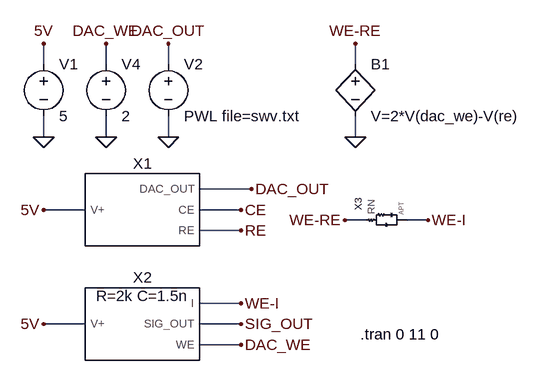
[diagram p0: schematic Mixed System.asc]
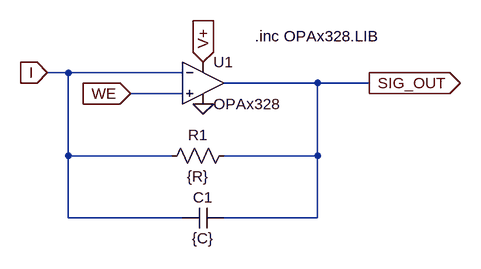
[diagram p1: sub-circuit opa2328_trans_amp.asc]
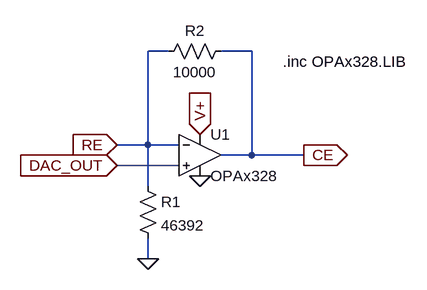
[diagram p2: sub-circuit opa2328_control_amp.asc]
Mixed System.asc, the LTspice schematic file:
Version 4
SHEET 1 880 680
WIRE -192 -128 -192 -160
WIRE -96 -128 -96 -160
WIRE 0 -128 0 -160
WIRE 288 -128 288 -160
WIRE -192 -16 -192 -48
WIRE -96 -16 -96 -48
WIRE 0 -16 0 -48
WIRE 288 -16 288 -48
WIRE 128 64 48 64
WIRE -128 96 -192 96
WIRE 112 96 48 96
WIRE 304 112 272 112
WIRE 400 112 368 112
WIRE 112 128 48 128
WIRE 112 240 48 240
WIRE -128 272 -192 272
WIRE 112 272 48 272
WIRE 112 304 48 304
FLAG -192 -16 0
FLAG -192 -160 5V
FLAG -192 96 5V
FLAG -192 272 5V
FLAG 0 -16 0
FLAG 0 -160 DAC_OUT
FLAG 128 64 DAC_OUT
FLAG 112 96 CE
FLAG 112 128 RE
FLAG 288 -160 WE-RE
FLAG 400 112 WE-I
FLAG 112 240 WE-I
FLAG 272 112 WE-RE
FLAG 112 272 SIG_OUT
FLAG -96 -16 0
FLAG -96 -160 DAC_WE
FLAG 112 304 DAC_WE
FLAG 288 -16 0
SYMBOL voltage -192 -144 R0
WINDOW 123 0 0 Left 0
WINDOW 39 0 0 Left 0
SYMATTR InstName V1
SYMATTR Value 5
SYMBOL voltage 0 -144 R0
WINDOW 123 0 0 Left 0
WINDOW 39 0 0 Left 0
SYMATTR InstName V2
SYMATTR Value PWL file=swv.txt
SYMBOL voltage -96 -144 R0
WINDOW 123 0 0 Left 0
WINDOW 39 0 0 Left 0
SYMATTR InstName V4
SYMATTR Value 2
SYMBOL bv 288 -144 R0
SYMATTR InstName B1
SYMATTR Value V=2*V(dac_we)-V(re)
SYMBOL OPA2328_Trans_Amp -48 272 R0
WINDOW 39 8 -28 Bottom 2
SYMATTR SpiceLine R=2k C=1.5n
SYMATTR InstName X2
SYMBOL randles 304 128 R270
SYMATTR InstName X3
SYMBOL OPA2328_Control_Amp -48 96 R0
SYMATTR InstName X1
TEXT 296 288 Left 2 !.tran 0 11 0

opa2328_trans_amp.asc, the sub-circuit schematic file:
Version 4
SHEET 1 880 680
WIRE 32 144 0 144
WIRE 208 144 32 144
WIRE 416 160 272 160
WIRE 496 160 416 160
WIRE 208 176 128 176
WIRE 32 272 32 144
WIRE 192 272 32 272
WIRE 416 272 416 160
WIRE 416 272 272 272
WIRE 32 368 32 272
WIRE 208 368 32 368
WIRE 416 368 416 272
WIRE 416 368 272 368
FLAG 240 192 0
FLAG 240 128 V+
IOPIN 240 128 In
FLAG 128 176 WE
IOPIN 128 176 In
FLAG 0 144 I
IOPIN 0 144 In
FLAG 496 160 SIG_OUT
IOPIN 496 160 Out
SYMBOL OpAmps\\opamp2 240 96 R0
SYMATTR InstName U1
SYMATTR Value OPAx328
SYMBOL res 288 256 R90
WINDOW 0 0 56 VBottom 2
WINDOW 3 32 56 VTop 2
SYMATTR InstName R1
SYMATTR Value {R}
SYMBOL cap 272 352 R90
WINDOW 0 0 32 VBottom 2
WINDOW 3 32 32 VTop 2
SYMATTR InstName C1
SYMATTR Value {C}
TEXT 320 88 Left 2 !.inc OPAx328.LIB

opa2328_control_amp.asc, the sub-circuit schematic file:
Version 4
SHEET 1 880 680
WIRE 240 -176 208 -176
WIRE 368 -176 320 -176
WIRE 208 -32 208 -176
WIRE 208 -32 160 -32
WIRE 256 -32 208 -32
WIRE 368 -16 368 -176
WIRE 368 -16 320 -16
WIRE 448 -16 368 -16
WIRE 256 0 160 0
WIRE 208 32 208 -32
WIRE 208 144 208 112
FLAG 288 -48 V+
IOPIN 288 -48 In
FLAG 288 16 0
FLAG 160 0 DAC_OUT
IOPIN 160 0 In
FLAG 160 -32 RE
IOPIN 160 -32 In
FLAG 208 144 0
FLAG 448 -16 CE
IOPIN 448 -16 Out
SYMBOL OpAmps\\opamp2 288 -80 R0
SYMATTR InstName U1
SYMATTR Value OPAx328
SYMBOL res 192 16 R0
SYMATTR InstName R1
SYMATTR Value 46392
SYMBOL res 336 -192 R90
WINDOW 0 0 56 VBottom 2
WINDOW 3 32 56 VTop 2
SYMATTR InstName R2
SYMATTR Value 10000
TEXT 416 -160 Left 2 !.inc OPAx328.LIB

The netlist it stands for:
* Mixed System.asc
V1 5V 0 5
V2 DAC_OUT 0 PWL file=swv.txt
V4 DAC_WE 0 2
B1 WE-RE 0 V=2*V(dac_we)-V(re)
XX2 WE-I 5V DAC_WE SIG_OUT opa2328_trans_amp params: R=2k C=1.5n
XX3 WE-RE WE-I randles  ; pins A B
XX1 DAC_OUT RE 5V CE opa2328_control_amp

* block symbol definitions
.subckt opa2328_trans_amp I V+ WE SIG_OUT
XU1 WE I V+ 0 SIG_OUT OPAx328  ; pins In+ In- V+ V- OUT
R1 SIG_OUT I {R}
C1 SIG_OUT I {C}
.inc OPAx328.LIB
.ends opa2328_trans_amp

.subckt opa2328_control_amp DAC_OUT RE V+ CE
XU1 DAC_OUT RE V+ 0 CE OPAx328  ; pins In+ In- V+ V- OUT
R1 RE 0 46392
R2 CE RE 10000
.inc OPAx328.LIB
.ends opa2328_control_amp

.tran 0 11 0
.backanno
.end

* Results of the author's LTspice run, read from the files saved beside the schematic
* Operating Point, zero values left out:
*   V(5v) = 5 V
*   V(dac_out) = 1.025 V
*   V(dac_we) = 2 V
*   V(we-re) = 2.975 V
*   V(sig_out) = 2 V
*   V(we-i) = 2 V
*   V(ce) = 1.246 V
*   V(re) = 1.025 V
*   I(B1) = -152 nA
*   I(V1) = -7.622 mA
*   I(V2) = 7.275 pA
*   I(V4) = 2.4 pA
*   Ix(x2:I) = 152.1 nA
*   Ix(x2:SIG_OUT) = -152.1 nA
*   Ix(x3:A) = 152 nA
*   Ix(x3:B) = -152 nA
*   Ix(x1:RE) = 7.475 pA
*   Ix(x1:CE) = 22.09 µA
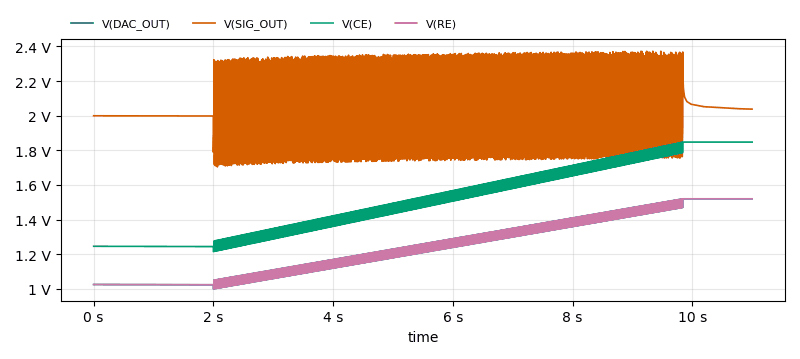
[diagram p3: Transient Analysis of Mixed System.asc, plotted from the saved traces]
* Transient Analysis, 1 run:
*   V(DAC_OUT): min 1 V, max 1.52 V, average 1.244 V, rms 1.257 V, last 1.52 V
*   V(SIG_OUT): min 1.703 V, max 2.374 V, average 2.038 V, rms 2.043 V, last 2.038 V
*   V(CE): min 1.216 V, max 1.848 V, average 1.513 V, rms 1.528 V, last 1.848 V
*   V(RE): min 1 V, max 1.52 V, average 1.244 V, rms 1.257 V, last 1.52 V